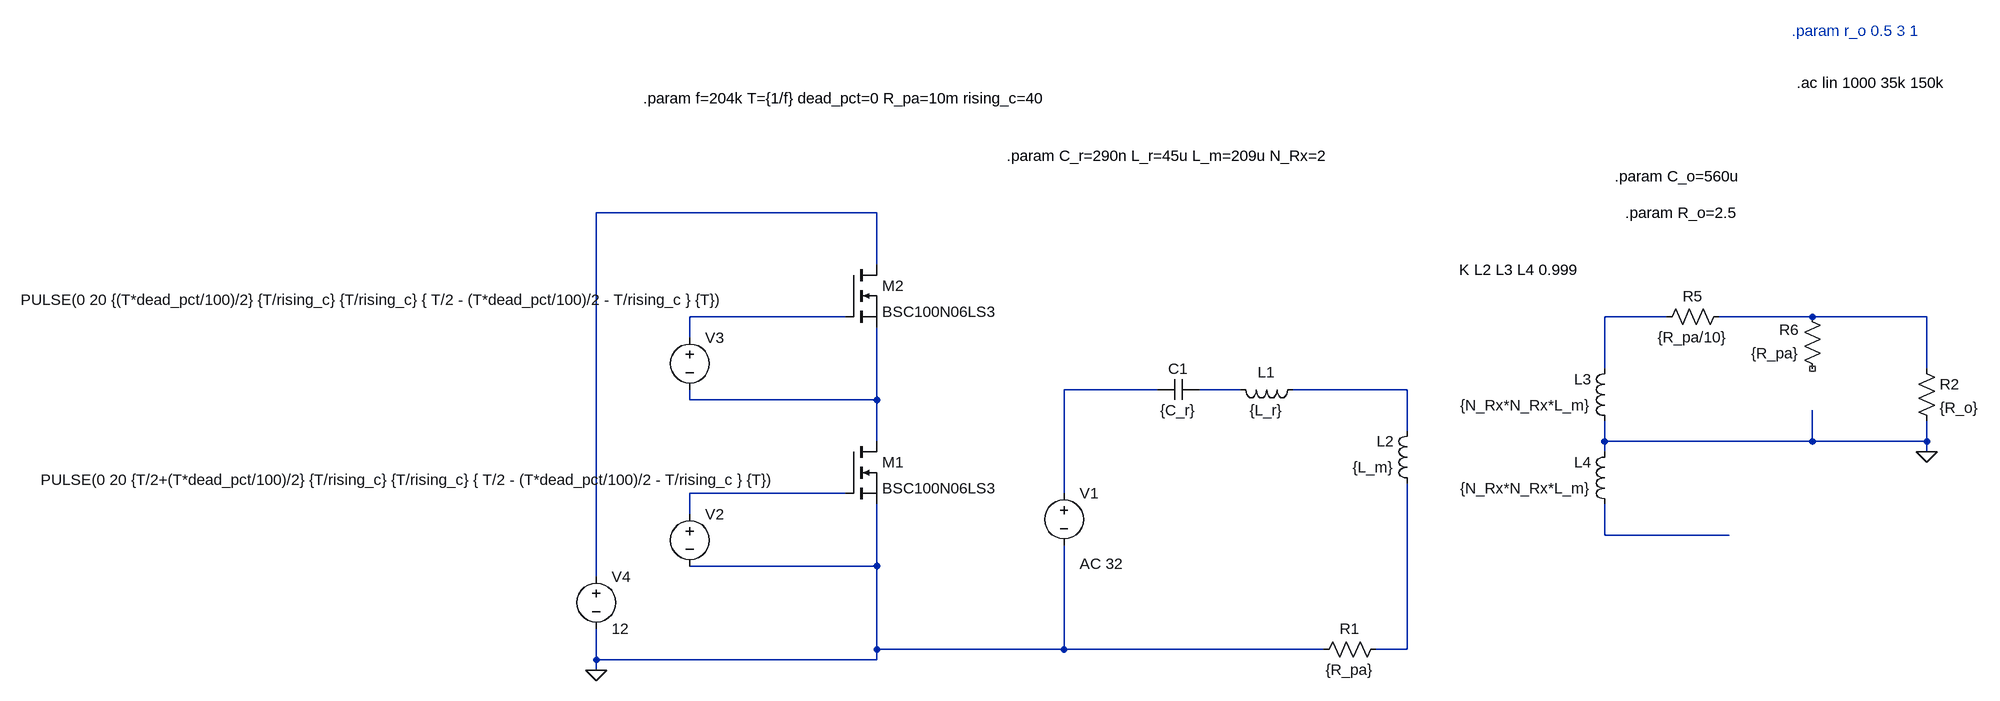
[diagram p0: schematic LLC_AC.asc]
LLC_AC.asc, the LTspice schematic file:
Version 4.1
SHEET 1 1940 680
WIRE 128 -448 -304 -448
WIRE 128 -368 128 -448
WIRE 80 -288 -160 -288
WIRE 1344 -288 1248 -288
WIRE 1568 -288 1424 -288
WIRE 1744 -288 1568 -288
WIRE -160 -256 -160 -288
WIRE 1248 -208 1248 -288
WIRE 1744 -208 1744 -288
WIRE 560 -176 416 -176
WIRE 688 -176 624 -176
WIRE 944 -176 768 -176
WIRE -160 -160 -160 -176
WIRE 128 -160 128 -272
WIRE 128 -160 -160 -160
WIRE 944 -112 944 -176
WIRE 128 -96 128 -160
WIRE 1248 -96 1248 -128
WIRE 1568 -96 1568 -144
WIRE 1568 -96 1248 -96
WIRE 1744 -96 1744 -128
WIRE 1744 -96 1568 -96
WIRE 1248 -80 1248 -96
WIRE 1744 -80 1744 -96
WIRE 80 -16 -160 -16
WIRE 416 -16 416 -176
WIRE -160 16 -160 -16
WIRE 1248 48 1248 0
WIRE 1440 48 1248 48
WIRE 128 96 128 0
WIRE 128 96 -160 96
WIRE -304 112 -304 -448
WIRE 128 224 128 96
WIRE 416 224 416 64
WIRE 416 224 128 224
WIRE 816 224 416 224
WIRE 944 224 944 -32
WIRE 944 224 896 224
WIRE -304 240 -304 192
WIRE 128 240 128 224
WIRE 128 240 -304 240
WIRE -304 256 -304 240
FLAG 1744 -80 0
FLAG -304 256 0
SYMBOL nmos 80 -96 R0
SYMATTR InstName M1
SYMATTR Value BSC100N06LS3
SYMBOL voltage -160 -272 R0
WINDOW 3 -1030 -42 Left 2
WINDOW 123 0 0 Left 0
WINDOW 39 0 0 Left 0
SYMATTR Value PULSE(0 20 {(T*dead_pct/100)/2} {T/rising_c} {T/rising_c} { T/2 - (T*dead_pct/100)/2 - T/rising_c } {T})
SYMATTR InstName V3
SYMBOL voltage -160 0 R0
WINDOW 3 -999 -37 Left 2
WINDOW 123 0 0 Left 0
WINDOW 39 0 0 Left 0
SYMATTR Value PULSE(0 20 {T/2+(T*dead_pct/100)/2} {T/rising_c} {T/rising_c} { T/2 - (T*dead_pct/100)/2 - T/rising_c } {T})
SYMATTR InstName V2
SYMBOL cap 624 -192 R90
WINDOW 0 0 32 VBottom 2
WINDOW 3 32 32 VTop 2
SYMATTR InstName C1
SYMATTR Value {C_r}
SYMBOL ind 784 -192 R90
WINDOW 0 5 56 VBottom 2
WINDOW 3 32 56 VTop 2
SYMATTR InstName L1
SYMATTR Value {L_r}
SYMBOL ind 960 -16 R180
WINDOW 0 36 80 Left 2
WINDOW 3 36 40 Left 2
SYMATTR InstName L2
SYMATTR Value {L_m}
SYMATTR Type ind
SYMBOL ind 1264 -112 R180
WINDOW 0 36 80 Left 2
WINDOW 3 36 40 Left 2
SYMATTR InstName L3
SYMATTR Value {N_Rx*N_Rx*L_m}
SYMATTR Type ind
SYMBOL ind 1264 16 R180
WINDOW 0 36 80 Left 2
WINDOW 3 36 40 Left 2
SYMATTR InstName L4
SYMATTR Value {N_Rx*N_Rx*L_m}
SYMATTR Type ind
SYMBOL res 1728 -224 R0
SYMATTR InstName R2
SYMATTR Value {R_o}
SYMBOL res 1440 -304 R90
WINDOW 0 0 56 VBottom 2
WINDOW 3 32 56 VTop 2
SYMATTR InstName R5
SYMATTR Value {R_pa/10}
SYMBOL res 1584 -192 R180
WINDOW 0 36 76 Left 2
WINDOW 3 36 40 Left 2
SYMATTR InstName R6
SYMATTR Value {R_pa}
SYMBOL voltage -304 96 R0
WINDOW 123 0 0 Left 0
WINDOW 39 0 0 Left 0
SYMATTR InstName V4
SYMATTR Value 12
SYMBOL res 912 208 R90
WINDOW 0 0 56 VBottom 2
WINDOW 3 32 56 VTop 2
SYMATTR InstName R1
SYMATTR Value {R_pa}
SYMBOL nmos 80 -368 R0
SYMATTR InstName M2
SYMATTR Value BSC100N06LS3
SYMBOL voltage 416 -32 R0
WINDOW 123 24 124 Left 2
WINDOW 39 0 0 Left 0
SYMATTR Value2 AC 32
SYMATTR InstName V1
SYMATTR Value ""
TEXT -232 -624 Left 2 !.param f=204k T={1/f} dead_pct=0 R_pa=10m rising_c=40
TEXT 328 -536 Left 2 !.param C_r=290n L_r=45u L_m=209u N_Rx=2
TEXT 1264 -504 Left 2 !.param C_o=560u
TEXT 1024 -360 Left 2 !K L2 L3 L4 0.999
TEXT 1536 -728 Left 2 ;.param r_o 0.5 3 1
TEXT 1544 -648 Left 2 !.ac lin 1000 35k 150k
TEXT 1280 -448 Left 2 !.param R_o=2.5

The netlist it stands for:
* LLC_AC.asc
M1 N008 N009 0 0 BSC100N06LS3
V3 N002 N008 PULSE(0 20 {(T*dead_pct/100)/2} {T/rising_c} {T/rising_c} { T/2 - (T*dead_pct/100)/2 - T/rising_c } {T})
V2 N009 0 PULSE(0 20 {T/2+(T*dead_pct/100)/2} {T/rising_c} {T/rising_c} { T/2 - (T*dead_pct/100)/2 - T/rising_c } {T})
C1 N006 N005 {C_r}
L1 N007 N006 {L_r}
L2 N011 N007 {L_m}
L3 0 N003 {N_Rx*N_Rx*L_m}
L4 N010 0 {N_Rx*N_Rx*L_m}
R2 N004 0 {R_o}
R5 N004 N003 {R_pa/10}
R6 NC_01 N004 {R_pa}
V4 N001 0 12
R1 N011 0 {R_pa}
M2 N001 N002 N008 N008 BSC100N06LS3
V1 N005 0 AC 32
.model NMOS NMOS
.model PMOS PMOS
.lib standard.mos
.param f=204k T={1/f} dead_pct=0 R_pa=10m rising_c=40
.param C_r=290n L_r=45u L_m=209u N_Rx=2
.param C_o=560u
K L2 L3 L4 0.999
* .param r_o 0.5 3 1
.ac lin 1000 35k 150k
.param R_o=2.5
.backanno
.end